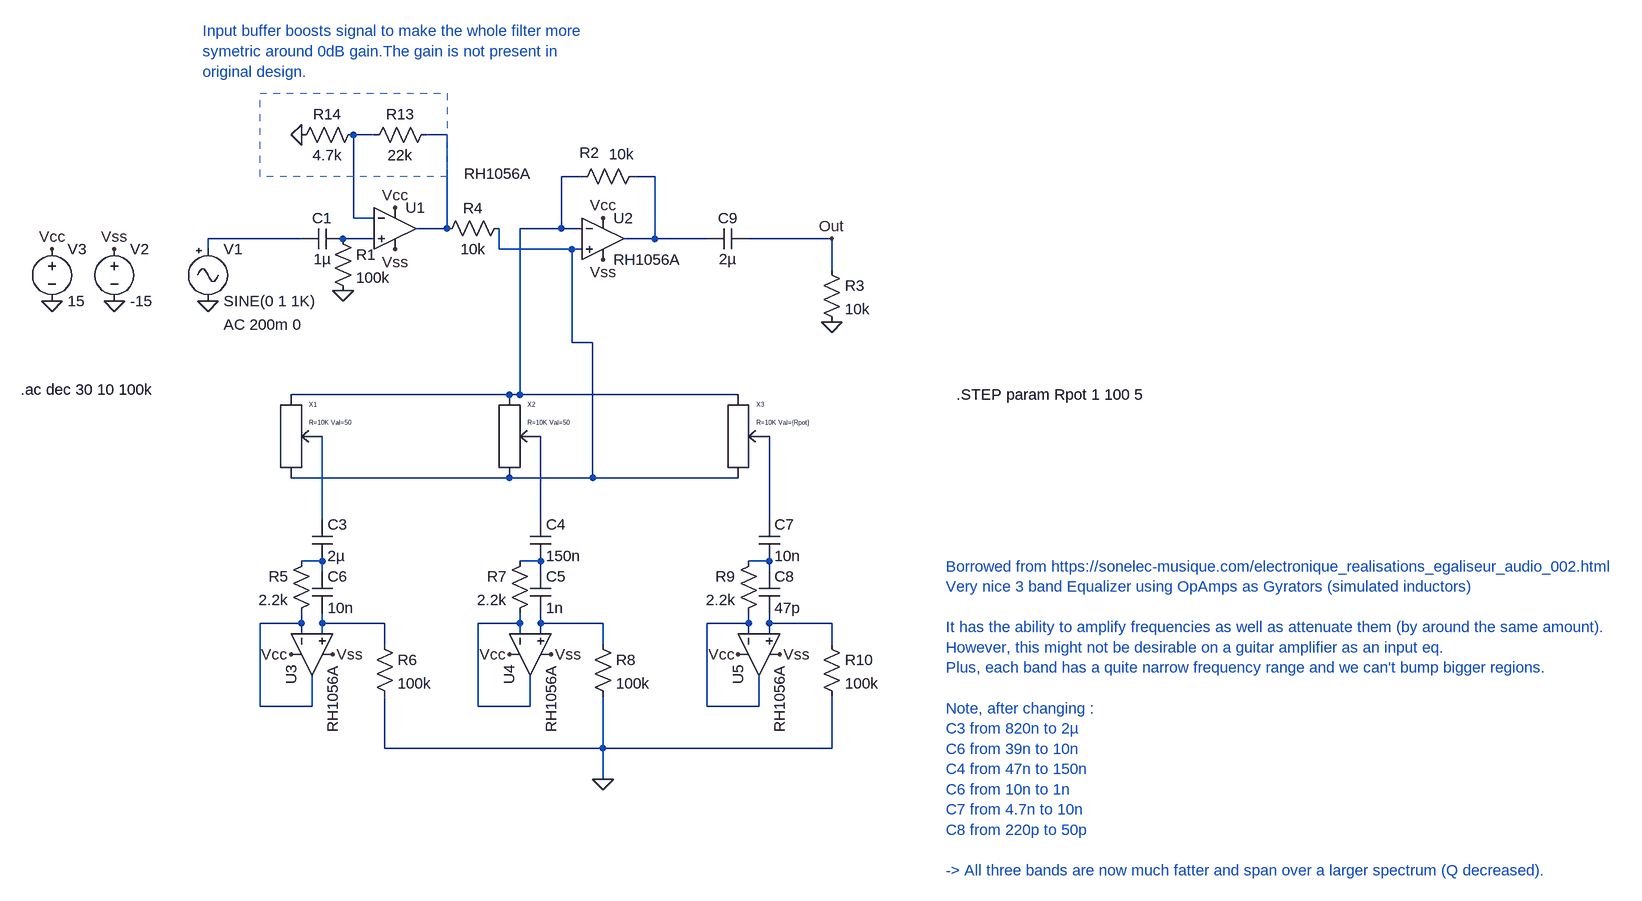
[diagram p0: schematic Sonelec-3bandEq.asc]
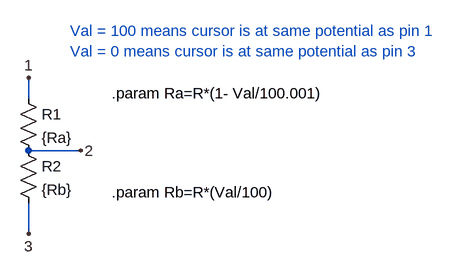
[diagram p1: sub-circuit potentiometer.asc]
Sonelec-3bandEq.asc, the LTspice schematic file:
Version 4
SHEET 1 1924 972
WIRE -112 -128 -144 -128
WIRE 0 -128 -32 -128
WIRE 208 -64 176 -64
WIRE 320 -64 288 -64
WIRE -144 0 -144 -128
WIRE -112 0 -144 0
WIRE 0 16 0 -128
WIRE 0 16 -48 16
WIRE 176 16 176 -64
WIRE 176 16 112 16
WIRE 208 16 176 16
WIRE -224 32 -368 32
WIRE -112 32 -160 32
WIRE 320 32 320 -64
WIRE 320 32 272 32
WIRE 400 32 320 32
WIRE 592 32 464 32
WIRE -368 48 -368 32
WIRE 80 48 80 16
WIRE 192 48 80 48
WIRE 208 48 192 48
WIRE 592 80 592 32
WIRE 192 192 192 48
WIRE 224 192 192 192
WIRE 96 272 -240 272
WIRE 112 272 112 16
WIRE 112 272 96 272
WIRE 448 272 112 272
WIRE 96 400 -240 400
WIRE 224 400 224 192
WIRE 224 400 96 400
WIRE 448 400 224 400
WIRE -192 464 -192 336
WIRE 144 464 144 336
WIRE 496 464 496 336
WIRE -192 528 -224 528
WIRE 144 528 112 528
WIRE 496 528 464 528
WIRE -192 544 -192 528
WIRE 144 544 144 528
WIRE 496 544 496 528
WIRE -224 624 -224 608
WIRE -224 624 -288 624
WIRE -192 624 -192 608
WIRE -96 624 -192 624
WIRE 112 624 112 608
WIRE 112 624 48 624
WIRE 144 624 144 608
WIRE 240 624 144 624
WIRE 464 624 464 608
WIRE 464 624 400 624
WIRE 496 624 496 608
WIRE 592 624 496 624
WIRE -224 640 -224 624
WIRE -192 640 -192 624
WIRE 112 640 112 624
WIRE 144 640 144 624
WIRE 464 640 464 624
WIRE 496 640 496 624
WIRE -96 656 -96 624
WIRE 240 656 240 624
WIRE 592 656 592 624
WIRE -288 752 -288 624
WIRE -208 752 -208 704
WIRE -208 752 -288 752
WIRE 48 752 48 624
WIRE 128 752 128 704
WIRE 128 752 48 752
WIRE 400 752 400 624
WIRE 480 752 480 704
WIRE 480 752 400 752
WIRE -96 816 -96 736
WIRE 240 816 240 736
WIRE 240 816 -96 816
WIRE 592 816 592 736
WIRE 592 816 240 816
WIRE 240 864 240 816
FLAG -608 128 0
FLAG -512 128 0
FLAG -368 128 0
FLAG -608 48 Vcc
FLAG -512 48 Vss
FLAG -80 -16 Vcc
FLAG -80 48 Vss
FLAG -160 112 0
FLAG 240 0 Vcc
FLAG 240 64 Vss
FLAG 592 160 0
FLAG 592 32 Out
FLAG -240 672 Vcc
FLAG -176 672 Vss
FLAG 96 672 Vcc
FLAG 160 672 Vss
FLAG 448 672 Vcc
FLAG 512 672 Vss
FLAG 240 864 0
FLAG -224 -128 0
SYMBOL Potentiometer -240 336 R0
WINDOW 39 28 -21 Left 0
SYMATTR InstName X1
SYMBOL OpAmps\\RH1056A -80 -48 R0
WINDOW 3 106 -20 Left 2
SYMATTR InstName U1
SYMBOL Misc\\signal -368 32 R0
WINDOW 123 24 132 Left 2
WINDOW 39 0 0 Left 0
SYMATTR InstName V1
SYMATTR Value2 AC 200m 0
SYMBOL voltage -512 32 R0
WINDOW 123 0 0 Left 0
WINDOW 39 0 0 Left 0
SYMATTR InstName V2
SYMATTR Value -15
SYMBOL voltage -608 32 R0
WINDOW 123 0 0 Left 0
WINDOW 39 0 0 Left 0
SYMATTR InstName V3
SYMATTR Value 15
SYMBOL cap -160 16 R90
WINDOW 0 0 32 VBottom 2
WINDOW 3 32 32 VTop 2
SYMATTR InstName C1
SYMATTR Value 1µ
SYMBOL res -176 16 R0
SYMATTR InstName R1
SYMATTR Value 100k
SYMBOL OpAmps\\RH1056A 240 -32 R0
SYMATTR InstName U2
SYMBOL res 304 -80 R90
WINDOW 0 -5 85 VBottom 2
WINDOW 3 -34 35 VTop 2
SYMATTR InstName R2
SYMATTR Value 10k
SYMBOL res 576 64 R0
SYMATTR InstName R3
SYMATTR Value 10k
SYMBOL res -16 32 R270
WINDOW 0 32 56 VTop 2
WINDOW 3 0 56 VBottom 2
SYMATTR InstName R4
SYMATTR Value 10k
SYMBOL cap -208 464 R0
SYMATTR InstName C3
SYMATTR Value 2µ
SYMBOL OpAmps\\RH1056A -272 672 M90
SYMATTR InstName U3
SYMBOL cap -208 544 R0
SYMATTR InstName C6
SYMATTR Value 10n
SYMBOL res -208 512 M0
SYMATTR InstName R5
SYMATTR Value 2.2k
SYMBOL res -112 640 R0
SYMATTR InstName R6
SYMATTR Value 100k
SYMBOL Potentiometer 96 336 R0
WINDOW 39 28 -21 Left 0
SYMATTR InstName X2
SYMBOL cap 128 464 R0
SYMATTR InstName C4
SYMATTR Value 150n
SYMBOL OpAmps\\RH1056A 64 672 M90
SYMATTR InstName U4
SYMBOL cap 128 544 R0
SYMATTR InstName C5
SYMATTR Value 1n
SYMBOL res 128 512 M0
SYMATTR InstName R7
SYMATTR Value 2.2k
SYMBOL res 224 640 R0
SYMATTR InstName R8
SYMATTR Value 100k
SYMBOL Potentiometer 448 336 R0
WINDOW 39 28 -21 Left 0
SYMATTR InstName X3
SYMATTR SpiceLine R=10K Val={Rpot}
SYMBOL cap 480 464 R0
SYMATTR InstName C7
SYMATTR Value 10n
SYMBOL OpAmps\\RH1056A 416 672 M90
SYMATTR InstName U5
SYMBOL cap 480 544 R0
SYMATTR InstName C8
SYMATTR Value 47p
SYMBOL res 480 512 M0
SYMATTR InstName R9
SYMATTR Value 2.2k
SYMBOL res 576 640 R0
SYMATTR InstName R10
SYMATTR Value 100k
SYMBOL cap 464 16 R90
WINDOW 0 0 32 VBottom 2
WINDOW 3 32 32 VTop 2
SYMATTR InstName C9
SYMATTR Value 2µ
SYMBOL res -16 -144 R90
WINDOW 0 0 56 VBottom 2
WINDOW 3 32 56 VTop 2
SYMATTR InstName R13
SYMATTR Value 22k
SYMBOL res -128 -144 R90
WINDOW 0 0 56 VBottom 2
WINDOW 3 32 56 VTop 2
SYMATTR InstName R14
SYMATTR Value 4.7k
TEXT -656 264 Left 2 !.ac dec 30 10 100k
TEXT 784 272 Left 2 !.STEP param Rpot 1 100 5
TEXT 768 536 Left 2 ;Borrowed from https://sonelec-musique.com/electronique_realisations_egaliseur_audio_002.html\nVery nice 3 band Equalizer using OpAmps as Gyrators (simulated inductors)\n \nIt has the ability to amplify frequencies as well as attenuate them (by around the same amount).\nHowever, this might not be desirable on a guitar amplifier as an input eq.\nPlus, each band has a quite narrow frequency range and we can't bump bigger regions.\n \nNote, after changing : \nC3 from 820n to 2µ\nC6 from 39n to 10n\nC4 from 47n to 150n\nC6 from 10n to 1n\nC7 from 4.7n to 10n\nC8 from 220p to 50p\n \n-> All three bands are now much fatter and span over a larger spectrum (Q decreased).
TEXT -376 -288 Left 2 ;Input buffer boosts signal to make the whole filter more \nsymetric around 0dB gain.The gain is not present in\noriginal design.
RECTANGLE Normal 0 -64 -288 -192 2

potentiometer.asc, the sub-circuit schematic file:
Version 4
SHEET 1 908 680
WIRE 192 96 192 64
WIRE 272 176 192 176
WIRE 192 304 192 256
FLAG 192 64 1
FLAG 272 176 2
FLAG 192 304 3
SYMBOL res 176 80 R0
SYMATTR InstName R1
SYMATTR Value {Ra}
SYMBOL res 176 160 R0
SYMATTR InstName R2
SYMATTR Value {Rb}
TEXT 320 88 Left 2 !.param Ra=R*(1- Val/100.001)
TEXT 320 240 Left 2 !.param Rb=R*(Val/100)
TEXT 256 -8 Left 2 ;Val = 100 means cursor is at same potential as pin 1\nVal = 0 means cursor is at same potential as pin 3

The netlist it stands for:
* Sonelec-3bandEq.asc
XX1 N003 N008 N007 potentiometer params: R=10K Val=50
XU1 N006 N001 Vcc Vss N002 RH1056A  ; pins In+ In- V+ V- OUT
V1 N005 0 SINE(0 1 1K) AC 200m 0
V2 Vss 0 -15
V3 Vcc 0 15
C1 N006 N005 1µ
R1 N006 0 100k
XU2 N007 N003 Vcc Vss N004 RH1056A  ; pins In+ In- V+ V- OUT
R2 N004 N003 10k
R3 Out 0 10k
R4 N002 N007 10k
C3 N008 N011 2µ
XU3 N015 N014 Vcc Vss N014 RH1056A  ; pins In+ In- V+ V- OUT
C6 N011 N015 10n
R5 N011 N014 2.2k
R6 N015 0 100k
XX2 N003 N009 N007 potentiometer params: R=10K Val=50
C4 N009 N012 150n
XU4 N017 N016 Vcc Vss N016 RH1056A  ; pins In+ In- V+ V- OUT
C5 N012 N017 1n
R7 N012 N016 2.2k
R8 N017 0 100k
XX3 N003 N010 N007 potentiometer params: R=10K Val={Rpot}
C7 N010 N013 10n
XU5 N019 N018 Vcc Vss N018 RH1056A  ; pins In+ In- V+ V- OUT
C8 N013 N019 47p
R9 N013 N018 2.2k
R10 N019 0 100k
C9 Out N004 2µ
R13 N002 N001 22k
R14 N001 0 4.7k

* block symbol definitions
.subckt potentiometer 1 2 3
R1 1 2 {Ra}
R2 2 3 {Rb}
.param Ra=R*(1- Val/100.001)
.param Rb=R*(Val/100)
* Val = 100 means cursor is at same potential as pin 1
* Val = 0 means cursor is at same potential as pin 3
.ends potentiometer

.ac dec 30 10 100k
.STEP param Rpot 1 100 5
* Borrowed from https://sonelec-musique.com/electronique_realisations_egaliseur_audio_002.html
* Very nice 3 band Equalizer using OpAmps as Gyrators (simulated inductors)
* It has the ability to amplify frequencies as well as attenuate them (by around the same amount).
* However, this might not be desirable on a guitar amplifier as an input eq.
* Plus, each band has a quite narrow frequency range and we can't bump bigger regions.
* Note, after changing :
* C3 from 820n to 2µ
* C6 from 39n to 10n
* C4 from 47n to 150n
* C6 from 10n to 1n
* C7 from 4.7n to 10n
* C8 from 220p to 50p
* -> All three bands are now much fatter and span over a larger spectrum (Q decreased).
* Input buffer boosts signal to make the whole filter more
* symetric around 0dB gain.The gain is not present in
* original design.
.backanno
.end